# EAGLE design glitchprog1b (EAGLE 4.00)
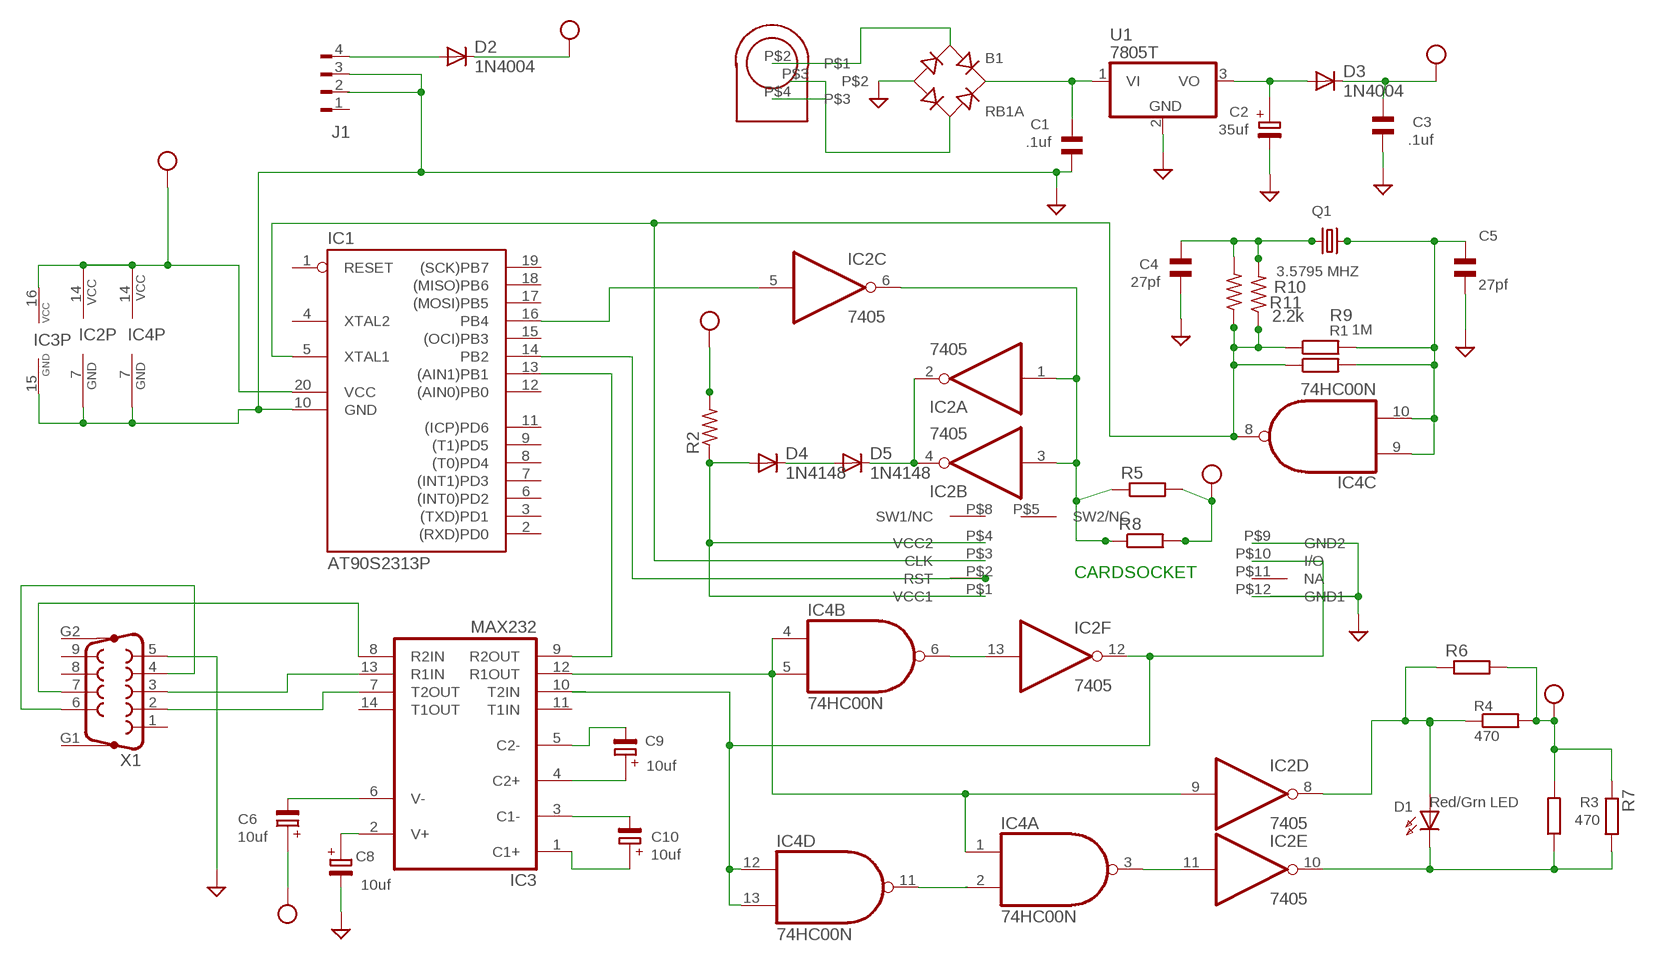
[diagram p0: schematic, sheet 1]

## Parts
B1  RB1A  [RB1A]
C1  .1uf  C2,5  [C5B3]
C2  35uf  E2,0-5  [E2,0-5]
C3  .1uf  C2,5  [C5B3]
C4  27pf  C2,5  [C5B3]
C5  27pf  C2,5  [C5B3]
C6  10uf  E2,0-5  [E2,0-5]
C8  10uf  E2,0-5  [E2,0-5]
C9  10uf  E2,0-5  [E2,0-5]
C10  10uf  E2,0-5  [E2,0-5]
CDR1  CHEAPREADR  [CHEAPREA]
D1  Red/Grn LED  LED2  [LED2]
D2  1N4004  [DO41-10]
D3  1N4004  [DO41-10]
D4  1N4148  [DO35-10]
D5  1N4148  [DO35-10]
IC1  AT90S2313P  [DIL20]
IC2  7405  [DIL14]
IC3  MAX232  [DIL16]
IC4  74HC00N  74ALS00N  [DIL14]
J1  FLOPPY-4  [FLOPPY-4]
Q1  3.5795 MHZ  HC49U-H  [HC49U-V]
R1  1M  0204V  [1210]
R2  R-US_0207/10  [0207/10]
R3  470  0204V  [1210]
R4  470  0204/5  [1210@2]
R5  R-EU_R2010  [R2010]
R6  R-EU_0204/7  [0204/7]
R7  R-EU_0204/7  [0204/7]
R8  R-EU_0204/7  [0204/7]
R9  R-EU_0204/7  [0204/7]
R10  R-US_0204/7  [0204/7]
R11  2.2k  R-US_M1206  [M1206]
U1  7805T  78XXT  [TO220H]
U$7  POWER1  [POWER1]
X1  F09HP  [F09HP]

## Nets
GND: B1.- C1.1 C2.- C3.1 C4.1 C5.1 C8.- CDR1.P$9(GND2) CDR1.P$12(GND1) IC1.10(GND) IC2.7(P:GND) IC3.15(GND) IC4.7(P:GND) J1.3 U1.2(GND) X1.5
N$1: C9.- IC3.5(C2-)
N$2: IC2.1(A:I) IC2.3(B:I) IC2.6(C:O) R5.1 R8.1
N$3: C10.- IC3.3(C1-)
N$4: C10.+ IC3.1(C1+)
N$5: C9.+ IC3.4(C2+)
N$6: C6.- IC3.6(V-)
N$7: C8.+ IC3.2(V+)
N$8: C4.2 Q1.1 R10.2 R11.2
N$9: IC1.13((AIN1)PB1) IC3.9(R2OUT)
N$10: CDR1.P$3(CLK) IC1.5(XTAL1) IC4.8(C:O) R1.1 R9.1 R10.1 R11.1
N$11: D4.K(C) D5.A
N$12: CDR1.P$2(RST) IC1.14(PB2)
N$13: IC3.8(R2IN) X1.7
N$15: B1.+ C1.2 U1.1(VI)
N$16: X1.4 X1.6
N$17: D1.A IC2.8(D:O) R4.1 R6.1
N$18: CDR1.P$10(I/O) IC2.12(F:O) IC3.10(T2IN) IC4.12(D:I0) IC4.13(D:I1)
N$19: CDR1.P$1(VCC1) CDR1.P$4(VCC2) D4.A R2.1
N$21: IC3.7(T2OUT) X1.2
N$22: D5.K(C) IC2.2(A:O) IC2.4(B:O)
N$23: IC2.9(D:I) IC3.12(R1OUT) IC4.1(A:I0) IC4.4(B:I0) IC4.5(B:I1)
N$24: D1.K IC2.10(E:O) R3.1 R7.2
N$25: B1.AC1 U$7.P$2
N$27: B1.AC2 U$7.P$3 U$7.P$4
N$28: IC2.13(F:I) IC4.6(B:O)
N$29: C5.2 IC4.9(C:I0) IC4.10(C:I1) Q1.2 R1.2 R9.2
N$31: IC4.2(A:I1) IC4.11(D:O)
N$34: IC3.13(R1IN) X1.3
N$36: IC1.16(PB4) IC2.5(C:I)
N$37: IC2.11(E:I) IC4.3(A:O)
N$41: C2.+ D3.A U1.3(VO)
N$42: D2.A J1.4
VCC: C3.2 C6.+ D2.K(C) D3.K(C) IC1.20(VCC) IC2.14(P:VCC) IC3.16(VCC) IC4.14(P:VCC) R2.2 R3.2 R4.2 R5.2 R6.2 R7.1 R8.2
Unconnected: CDR1.P$5(SW2/NC) CDR1.P$8(SW1/NC) CDR1.P$11(NA) IC1.1(RESET) IC1.2((RXD)PD0) IC1.3((TXD)PD1) IC1.4(XTAL2) IC1.6((INT0)PD2) IC1.7((INT1)PD3) IC1.8((T0)PD4) IC1.9((T1)PD5) IC1.11((ICP)PD6) IC1.12((AIN0)PB0) IC1.15((OCI)PB3) IC1.17((MOSI)PB5) IC1.18((MISO)PB6) IC1.19((SCK)PB7) IC3.11(T1IN) IC3.14(T1OUT) J1.1 J1.2 X1.1 X1.8 X1.9 X1.G1 X1.G2

## Library data of the parts
B1 = rectif:RB1A
C1 C3-C5 = cap:C2,5
C2 C6 C8-C10 = cap-pan:E2,0-5
CDR1 = unlooper:CHEAPREADR
D1 = led:LED2
D2 D3 = diode:1N4004: DIODE general purpose rectifier, 1 A
D4 D5 = diode:1N4148: DIODE high speed (Philips)
IC1 = atmel:AT90S2313: MICROCONTROLLER 2 Kbytes FLASH 128 bytes SRAM 128 bytes EEPROM UART
IC2 = 74xxsmd:7405
IC3 = maxim:MAX232: RS232 TRANSEIVER
IC4 = 74xx-us:74*00: Quad 2-input NAND gate
J1 = con-amp:FLOPPY-4: AMP CONNECTOR
Q1 = quartz:HC49U-H
R1 R3 = r:0204V
R2 R10 R11 = rcl:R-US_: RESISTOR, American symbol
R4 = r:0204/5
R5-R9 = rcl:R-EU_: RESISTOR, European symbol
U1 = linear:78XXT: Positive VOLTAGE REGULATOR
U$7 = unlooper:POWER1
X1 = con-subd:F09HP: HARTING SUB-D

## Board
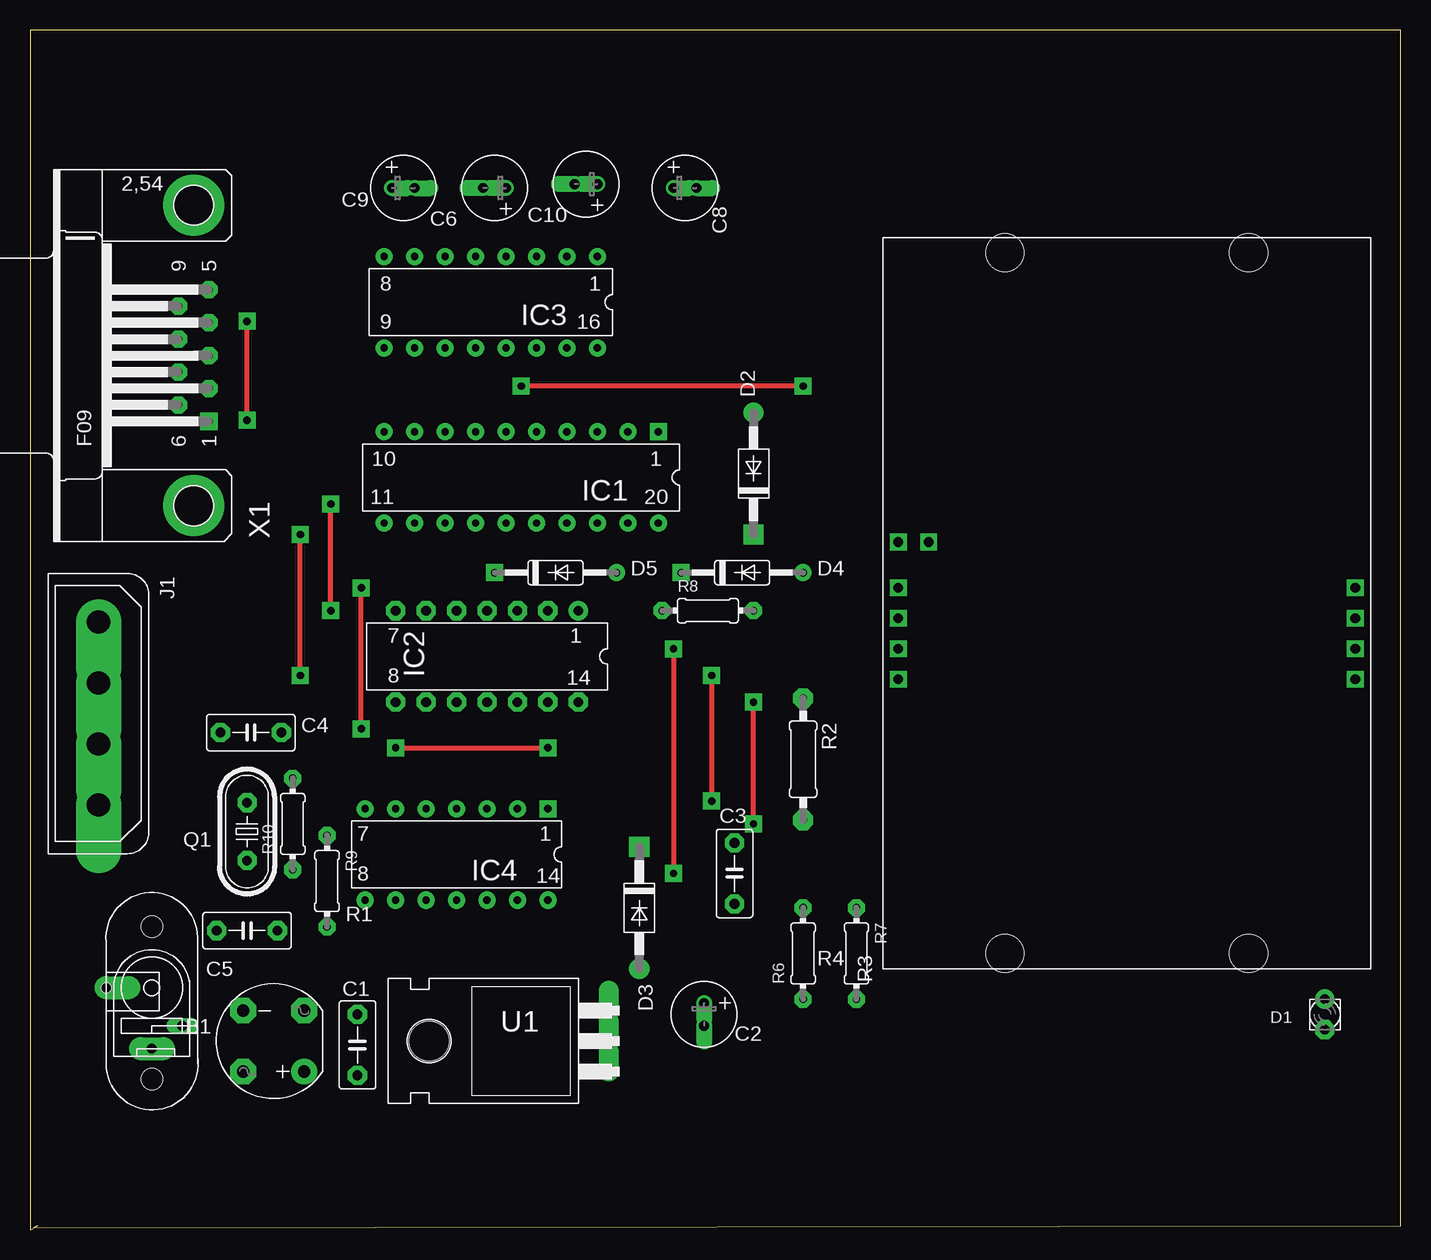
[diagram p1: board, top side]
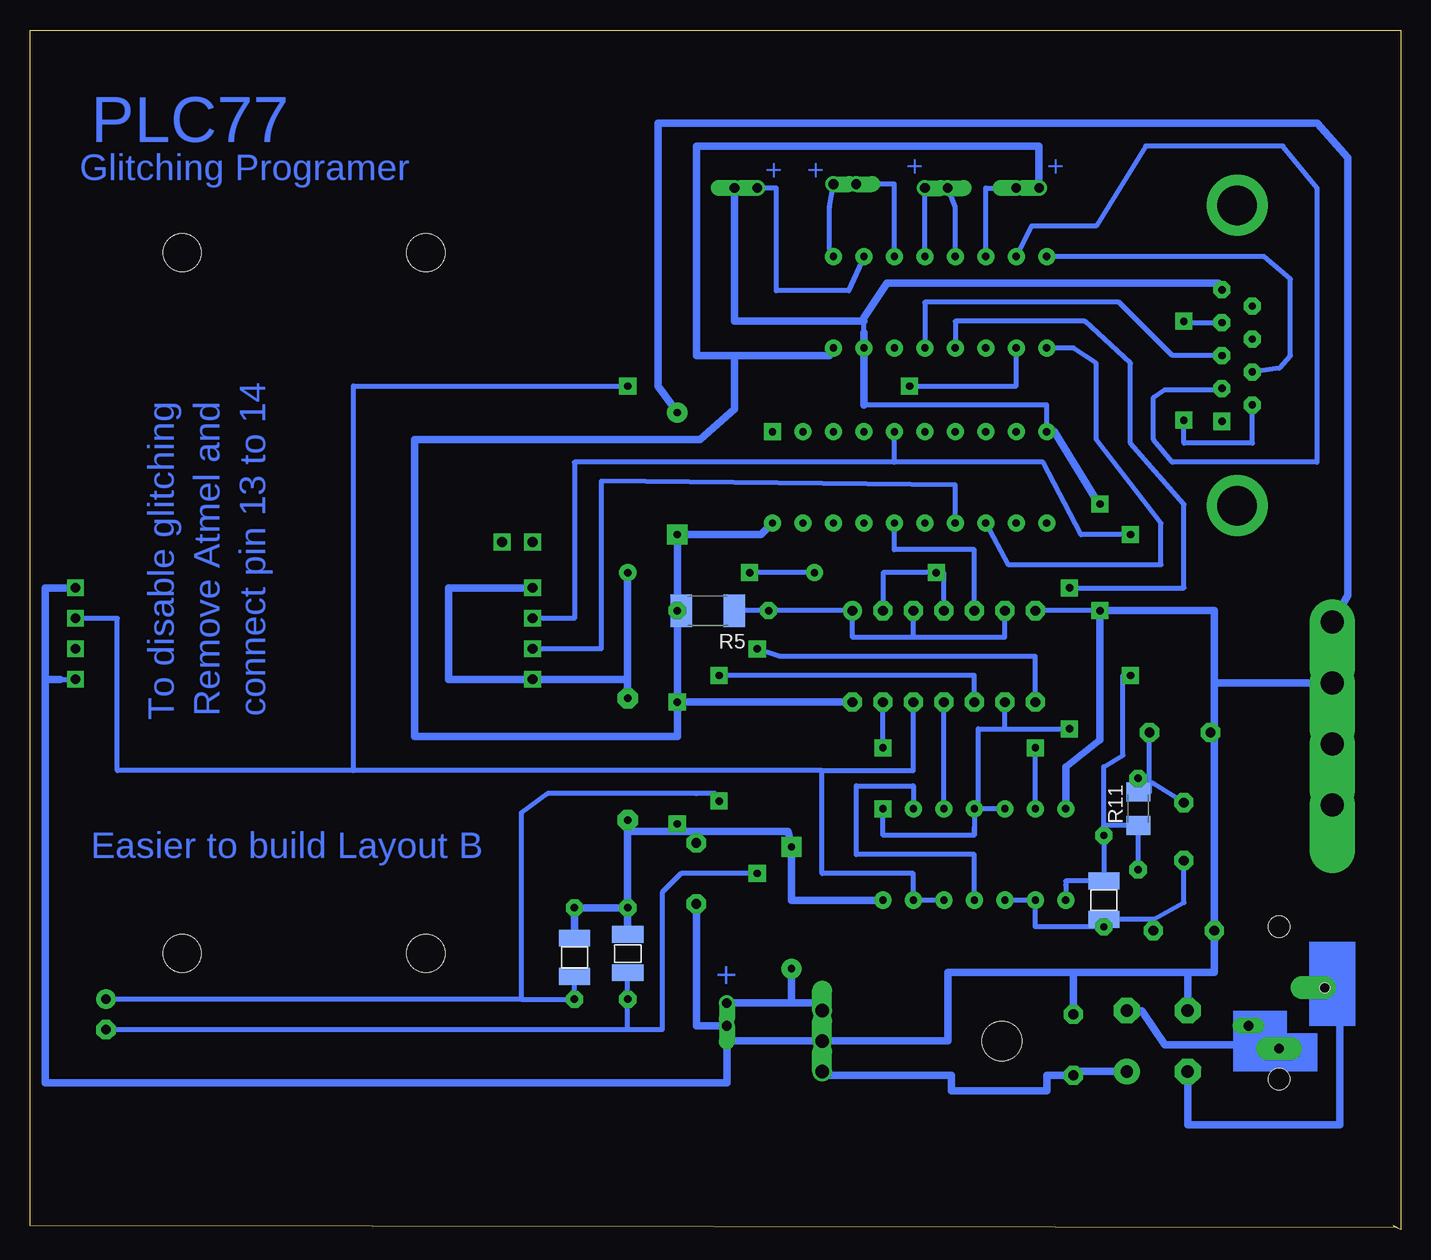
[diagram p2: board, bottom side, seen from below]

Size 114.28 x 100 mm. Coordinates in mm from the lower left corner, seen from the top.
Outline: 0,0 0.63,0.32 0.31,0.15 114.28,0.32 114.28,100 0,100 0,0
Copper layers used: Top, Bottom

### Footprints (pad centres in the part's own frame; a part is rotated, then mirrored left to right if it is on the bottom)
RB1A = drill 1.016 pad 2.159 round: + -2.54,2.54 | drill 1.016 pad 2.159 octagon: - 2.54,-2.54; AC1 2.54,2.54; AC2 -2.54,-2.54
C5B3 = drill 0.813 pad 1.6 octagon: 1 -2.54,0; 2 2.54,0
E2,0-5 = drill 0.813 pad 1.27 offset: + -0.953,0; - 0.953,0
CHEAPREA = drill 0.813 pad 1.397 square: P$1 -19.05,-6.35; P$2 -19.05,-3.81; P$3 -19.05,-1.27; P$4 -19.05,1.27; P$5 -19.05,5.08; P$8 -16.51,5.08; P$9 19.05,1.27; P$10 19.05,-1.27; P$11 19.05,-3.81; P$12 19.05,-6.35 | hole 3.175: 10.16,29.21; -10.16,29.21; -10.16,-29.21; 10.16,-29.21
LED2 = drill 0.813 pad 1.6 octagon: A -1.27,0 | drill 0.813 pad 1.6 round: K 1.27,0
DO41-10 = drill 0.61 pad 1.676 round: A 5.08,0 | drill 0.61 pad 1.676 square: K -5.08,0
DO35-10 = drill 0.61 pad 1.422 round: A 5.08,0 | drill 0.61 pad 1.422 square: K -5.08,0
DIL20 = drill 0.61 pad 1.422 square: 1 -11.43,-3.81 | drill 0.61 pad 1.422 round: 2 -8.89,-3.81; 3 -6.35,-3.81; 4 -3.81,-3.81; 5 -1.27,-3.81; 6 1.27,-3.81; 7 3.81,-3.81; 8 6.35,-3.81; 9 8.89,-3.81; 10 11.43,-3.81; 11 11.43,3.81; 12 8.89,3.81; 13 6.35,3.81; 14 3.81,3.81; 15 1.27,3.81; 16 -1.27,3.81; 17 -3.81,3.81; 18 -6.35,3.81; 19 -8.89,3.81; 20 -11.43,3.81
DIL14 = drill 0.813 pad 1.6 round: 1 -7.62,-3.81 | drill 0.813 pad 1.6 octagon: 2 -5.08,-3.81; 3 -2.54,-3.81; 4 0,-3.81; 5 2.54,-3.81; 6 5.08,-3.81; 7 7.62,-3.81; 8 7.62,3.81; 9 5.08,3.81; 10 2.54,3.81; 11 0,3.81; 12 -2.54,3.81; 13 -5.08,3.81; 14 -7.62,3.81
DIL16 = drill 0.61 pad 1.422 round: 1 -8.89,-3.81; 2 -6.35,-3.81; 3 -3.81,-3.81; 4 -1.27,-3.81; 5 1.27,-3.81; 6 3.81,-3.81; 7 6.35,-3.81; 8 8.89,-3.81; 9 8.89,3.81; 10 6.35,3.81; 11 3.81,3.81; 12 1.27,3.81; 13 -1.27,3.81; 14 -3.81,3.81; 15 -6.35,3.81; 16 -8.89,3.81
DIL14' = drill 0.61 pad 1.422 square: 1 -7.62,-3.81 | drill 0.61 pad 1.422 round: 2 -5.08,-3.81; 3 -2.54,-3.81; 4 0,-3.81; 5 2.54,-3.81; 6 5.08,-3.81; 7 7.62,-3.81; 8 7.62,3.81; 9 5.08,3.81; 10 2.54,3.81; 11 0,3.81; 12 -2.54,3.81; 13 -5.08,3.81; 14 -7.62,3.81
FLOPPY-4 = drill 1.93 pad 3.81 offset: 1 7.62,0; 2 2.54,0; 3 -2.54,0; 4 -7.62,0
HC49U-V = drill 0.813 pad 1.6 octagon: 1 -2.413,0; 2 2.413,0
1210 = smd 1.397 x 2.591: 1 -1.6,0; 2 1.6,0
0207/10 = drill 0.61 pad 1.676 octagon: 1 -5.08,0; 2 5.08,0
R2010 = smd 1.8 x 2.7: 1 -2.2,0; 2 2.2,0
0204/7 = drill 0.61 pad 1.422 octagon: 1 -3.81,0; 2 3.81,0
M1206 = smd 1.6 x 2: 1 -1.4,0; 2 1.4,0
TO220H = drill 1.118 offset: 1 -2.54,-10.16; 2 0,-10.16; 3 2.54,-10.16 | hole 3.302: 0,4.826
POWER1 = drill 0.813 pad 1.905 offset: P$2 -3.81,0 | drill 0.813 pad 1.905 long: P$3 0,-5.08 | drill 0.813 pad 1.27 long: P$4 2.54,-3.175 | hole 1.778: 0,5.08; 0,-7.62 | hole 0.813: -3.81,0
F09HP = drill 0.61 pad 1.422 square: 1 -5.486,-1.27 | drill 0.61 pad 1.422 octagon: 2 -2.743,-1.27; 3 0,-1.27; 4 2.743,-1.27; 5 5.486,-1.27; 6 -4.115,1.27; 7 -1.372,1.27; 8 1.372,1.27; 9 4.115,1.27 | drill 3.302 pad 5.08 round: G1 -12.522,0; G2 12.522,0

### Placement (x,y rotation side)
B1  20.31,15.71 180 top
C1  27.3,15.39 270 top
C2  56.19,17.93 270 top
C3  58.73,29.68 90 top
C4  18.41,41.43 0 top
C5  18.09,24.92 0 top
C6  31.11,86.83 0 top
C8  54.61,86.83 0 top
C9  38.73,86.83 180 top
C10  46.35,87.15 180 top
CDR1  91.43,52.22 0 top
D1  107.94,17.93 90 top
D2  60.32,63.02 90 top
D3  50.8,26.82 270 top
D4  59.37,54.76 0 top
D5  43.81,54.76 0 top
IC1  40.95,62.7 180 top
IC2  38.09,47.78 180 top
IC3  38.41,77.31 180 top
IC4  74HC00N  [DIL14']  35.55,31.27 180 top
J1  5.71,43.02 270 top
Q1  18.09,33.17 270 top
R1  24.76,27.46 270 bottom
R2  64.45,39.21 270 top
R3  68.89,22.7 90 bottom
R4  470  [1210]  64.45,23.01 90 bottom
R5  57.78,51.59 180 bottom
R6  64.45,23.01 90 top
R7  68.89,23.01 270 top
R8  56.51,51.59 0 top
R9  24.76,29.04 270 top
R10  21.9,33.81 90 top
R11  21.9,35.08 90 bottom
U1  38.09,15.71 90 top
U$7  10.15,20.15 0 top
X1  13.65,72.86 90 top

### Tracks (layer width: path | path; a pad name or v marks a point on that pad's centre or on a via)
GND  (via drill 0.61 pad 1.42)
  Top 0.406: v25.08,51.59 v25.08,60.48
  Bottom 0.406: U1.2 47.94,15.71 | C4.1 16.19,41.43 16.19,41.75 15.55,41.75 | C2.- 56.51,17.3 | 44.76,75.72 44.76,74.77 44.76,76.03 | 111.76,45.87 CDR1.P$12 | 44.76,68.73 29.52,68.73 IC1.10 28.89,66.51 | v25.08,60.48 25.4,60.8 | v25.08,51.59 IC2.7 | 15.23,78.89 X1.5
  Bottom 0.61: 56.19,15.71 U1.2 37.78,15.71 37.78,21.43 27.3,21.43 | 27.3,21.43 C1.1 | 17.78,21.43 27.3,21.43 | B1.- 17.78,21.43 | 17.78,21.43 15.55,21.43 C5.1 15.55,41.75 15.55,45.55 | IC4.7 27.94,38.57 25.08,40.79 v25.08,51.59 15.55,51.59 15.55,45.55 | 113.02,45.87 113.02,12.22 56.19,12.22 56.19,15.71 | 56.19,15.71 C2.- 58.73,16.98 C3.1 | 44.76,75.72 55.56,75.72 C8.- | 44.76,74.77 IC3.15 44.76,68.73 | 44.76,76.03 42.86,78.89 15.23,78.89 | 113.02,45.87 111.76,45.87 | 113.02,45.87 113.02,53.49 CDR1.P$9 | 25.4,60.8 28.89,66.51 | 15.55,45.55 J1.3 5.71,40.16
N$1
  Bottom 0.406: IC3.5 37.14,85.24 C9.-
N$2
  Bottom 0.406: IC2.1 45.72,49.37 40.64,49.37 | IC2.6 33.01,49.37 40.64,49.37 | 40.64,49.37 IC2.3 | IC2.1 R8.1 | IC2.1 R5.1
N$3
  Bottom 0.406: IC3.3 42.22,87.15 C10.-
N$4
  Bottom 0.406: 47.62,81.75 47.62,81.43 | IC3.1 47.62,81.75 | C10.+ 47.62,85.24 47.62,81.75
N$5
  Bottom 0.406: IC3.4 C9.+
N$6
  Bottom 0.406: IC3.6 34.6,86.83 C6.-
N$7
  Bottom 0.406: IC3.2 46.03,78.26 52.07,78.26 52.07,86.83 C8.+
N$8
  Bottom 0.406: Q1.1 20.63,37.17 20.95,37.3 | 20.95,37.3 C4.2 | R10.2 R11.2 20.95,36.48 20.95,37.3
N$9
  Bottom 0.406: IC3.9 27.3,73.5 25.4,72.23 25.4,65.88 20,58.89 20,55.4 32.7,55.4 IC1.13
N$10  (via drill 0.61 pad 1.42)
  Top 0.406: v22.54,46.19 v22.54,57.94
  Bottom 0.406: 42.22,63.97 IC1.5 | 42.22,63.97 68.89,63.97 68.89,50.95 CDR1.P$3 | 27.94,29.06 R1.1 R9.1 | 27.94,29.06 27.94,28.73 | 27.94,29.06 IC4.8 | 42.22,63.97 29.84,63.97 26.67,57.94 v22.54,57.94 | v22.54,46.19 23.17,46.19 23.17,39.52 24.76,38.57 R9.1 | R11.1 21.9,33.81 | R10.1 R11.1 | R11.1 24.76,33.68 R9.1
N$11
  Bottom 0.406: D5.A D4.K
N$12
  Bottom 0.406: CDR1.P$2 66.67,48.41 66.67,62.38 37.14,62.07 IC1.14
N$13
  Bottom 0.406: IC3.8 11.43,81.12 9.2,79.21 9.2,72.86 10.15,71.81 X1.7
N$15
  Bottom 0.406: 26.67,13.17 C1.2 | 48.26,12.85 U1.1
  Bottom 0.61: C1.2 29.52,12.85 29.52,11.58 37.46,11.58 37.46,12.85 48.26,12.85 | B1.+ 26.67,13.17
N$16  (via drill 0.61 pad 1.42)
  Top 0.406: v18.09,67.46 v18.09,75.72
  Bottom 0.406: X1.4 18.09,75.6 v18.09,75.72 | v18.09,67.46 18.09,65.56 12.38,65.56 X1.6
N$17  (via drill 0.61 pad 1.42)
  Top 0.406: v53.65,48.41 v53.65,29.68
  Bottom 0.406: IC2.8 30.47,47.78 51.75,47.78 v53.65,48.41 | 64.45,16.66 D1.A | R4.1 R6.1 64.45,16.66 | v53.65,29.68 60,29.68 61.59,28.09 61.59,16.66 64.45,16.66
N$18  (via drill 0.61 pad 1.42)
  Top 0.406: v64.45,70.32 v40.95,70.32
  Bottom 0.406: IC2.12 40.64,38.25 48.26,38.25 | 48.26,38.25 87.31,38.25 | 87.31,38.25 106.99,38.25 106.99,50.95 CDR1.P$10 | IC4.12 IC4.13 40.64,29.68 48.26,29.68 48.26,38.25 | IC3.10 32.06,70.32 v40.95,70.32 | v64.45,70.32 87.31,70.32 87.31,38.25
N$19
  Bottom 0.406: CDR1.P$4 73.66,53.49
  Bottom 0.61: R2.1 64.45,45.87 | 64.45,45.87 CDR1.P$1 79.37,45.87 79.37,53.49 CDR1.P$4 | 64.45,45.87 D4.A
N$21
  Bottom 0.406: IC3.7 30.79,83.66 25.4,83.66 21.27,90.32 9.84,90.32 6.98,86.83 6.98,63.97 19.04,63.97 20.63,65.88 20.63,69.37 19.68,70 14.92,70 X1.2
N$22
  Bottom 0.406: IC2.2 43.18,54.76 D5.K 38.09,54.76 IC2.4
N$23  (via drill 0.61 pad 1.42)
  Top 0.406: v27.62,41.75 v27.62,53.49
  Bottom 0.406: IC3.12 37.14,75.72 26.35,75.72 22.54,72.23 22.54,65.56 18.09,60.48 18.09,53.49 v27.62,53.49 | IC4.4 35.55,34.76 | 35.24,35.08 IC4.4 | IC4.5 35.24,35.08 | 35.24,35.08 35.24,41.75 33.01,41.75 | IC4.1 43.18,32.86 35.55,32.86 | 35.55,32.86 35.55,33.49 | IC4.4 35.55,32.86 | 33.01,41.75 IC2.9 | 33.01,41.75 v27.62,41.75
N$24  (via drill 0.61 pad 1.42)
  Top 0.406: v56.83,46.19 v56.83,35.71
  Bottom 0.406: IC2.10 35.55,46.19 v56.83,46.19 | v56.83,35.71 57.15,36.35 58.73,36.34 71.12,36.35 73.34,34.75 73.34,19.2 | R3.1 R7.2 73.34,19.2 | 73.34,19.2 D1.K
N$25
  Bottom 0.406: 5.07,20.15 U$7.P$2 | B1.AC1 16.82,13.49
  Bottom 0.61: 5.07,20.15 5.07,8.72 17.78,8.72 B1.AC1
N$27
  Bottom 0.406: U$7.P$4 11.11,15.39 11.11,15.07 U$7.P$3 | B1.AC2 22.22,18.25
  Bottom 0.61: 11.11,15.39 19.68,15.39 21.58,18.25 B1.AC2
N$28  (via drill 0.61 pad 1.42)
  Top 0.406: v30.47,40.16 v43.18,40.16
  Bottom 0.406: v43.18,40.16 IC2.13 | IC4.6 v30.47,40.16
N$29
  Bottom 0.406: Q1.2 18.09,27.27 20.63,25.87 | 20.63,24.6 C5.2 20.63,25.87 | 20.63,25.87 R1.2 | IC4.9 IC4.10 | IC4.9 30.47,27.77 | IC4.9 30.47,25.23 R9.2 | R1.2 R9.2 | R1.2 R9.2
N$31
  Bottom 0.406: IC4.11 35.55,31.27 45.4,31.27 45.4,36.98 40.64,36.98 IC4.2
N$34
  Bottom 0.406: IC3.13 39.68,77.31 23.49,77.31 19.04,72.86 X1.3
N$36
  Bottom 0.406: IC2.5 35.55,56.67 42.22,56.67 IC1.16 41.9,58.89
N$37
  Bottom 0.406: IC4.3 IC2.11
N$41
  Bottom 0.406: C2.+ 53.02,18.88 | U1.3 48.26,18.88
  Bottom 0.61: C2.+ 48.26,18.88 50.79,18.88 D3.A
N$42
  Bottom 0.61: J1.4 4.44,52.86 4.44,89.37 6.98,92.23 61.91,92.23 61.91,70.32 D2.A
VCC  (via drill 0.61 pad 1.42)
  Top 0.406: v60.32,33.81 v60.32,43.97
  Bottom 0.406: 58.41,33.17 C3.2 | 47.62,72.86 IC3.16 | 60.64,33.17 v60.32,33.81 | 64.45,33.17 R2.2 | v60.32,43.97 R8.2 | R8.2 R5.2 | R8.2 D2.K | R3.2 68.89,24.28 | R4.2
  Bottom 0.61: IC4.14 50.79,27.46 D3.K 51.11,33.17 58.41,33.17 60.64,33.17 64.45,33.17 R6.2 | C6.+ 30.16,90.32 58.73,90.32 58.73,72.86 55.56,72.86 | 55.56,72.86 47.62,72.86 | IC1.20 53.33,57.94 D2.K R8.2 v60.32,43.97 | 55.56,72.86 55.56,68.42 58.41,65.88 82.23,65.88 82.23,41.11 60.32,41.11 v60.32,43.97 | v60.32,43.97 IC2.14 | R6.2 R7.1 R3.2 | R6.2 R4.2

### Text on the board
Bottom: PLC77 | + | + | + | + | Glitching Programer | connect pin 13 to 14 | Remove Atmel and | To disable glitching | Easier to build Layout B | +